# Altium schematic sheet SM3350_BOX.SchDoc
size A2; SheetNumber: 1; SheetTotal: 1
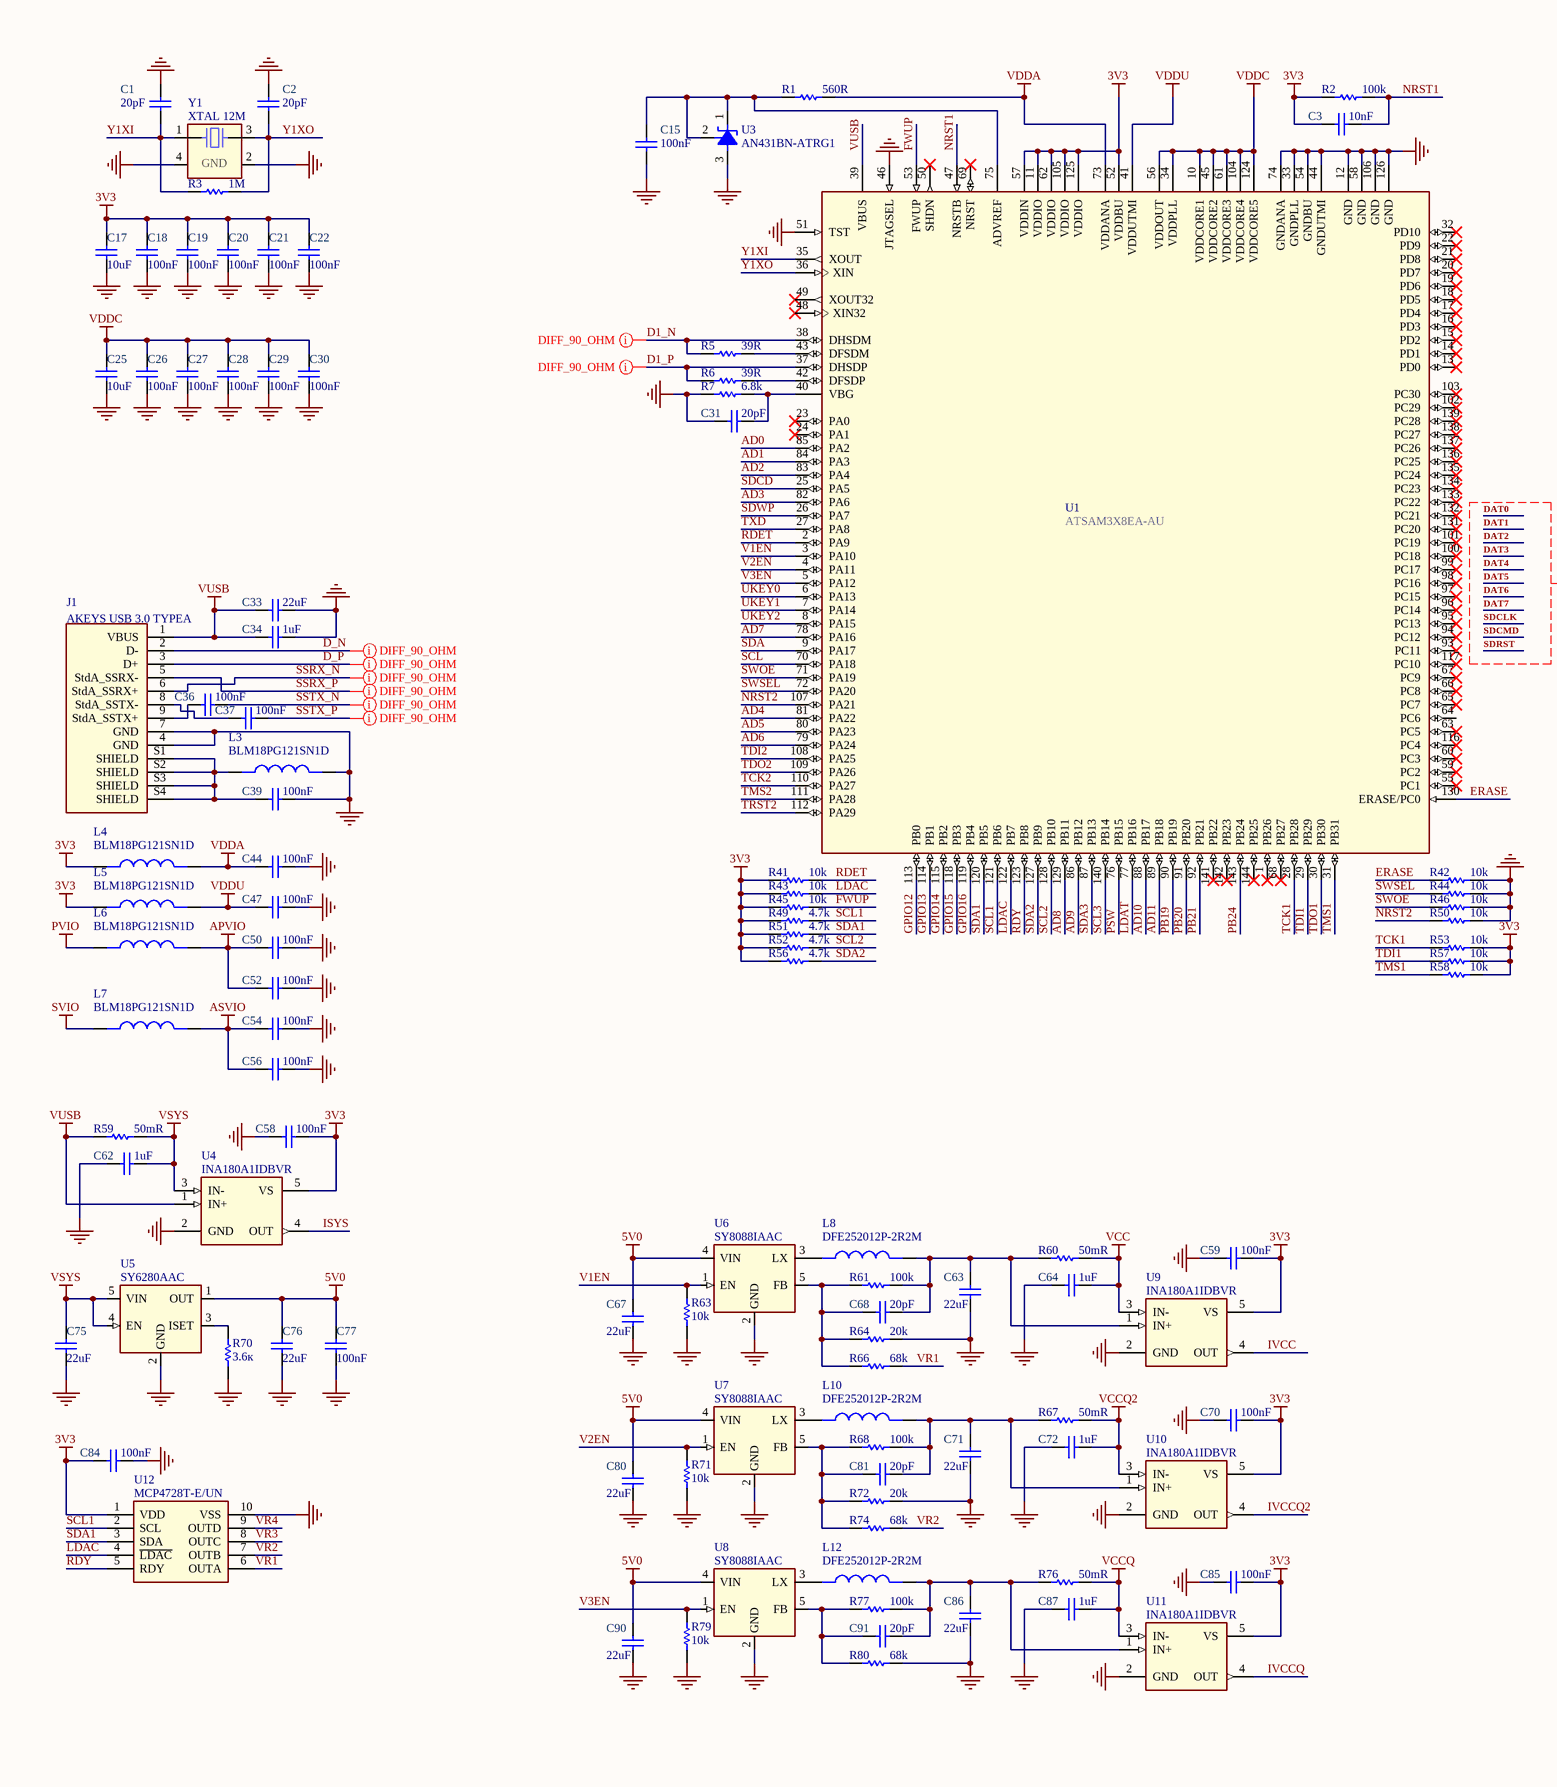
[diagram p0: SM3350_BOX.SchDoc, left]
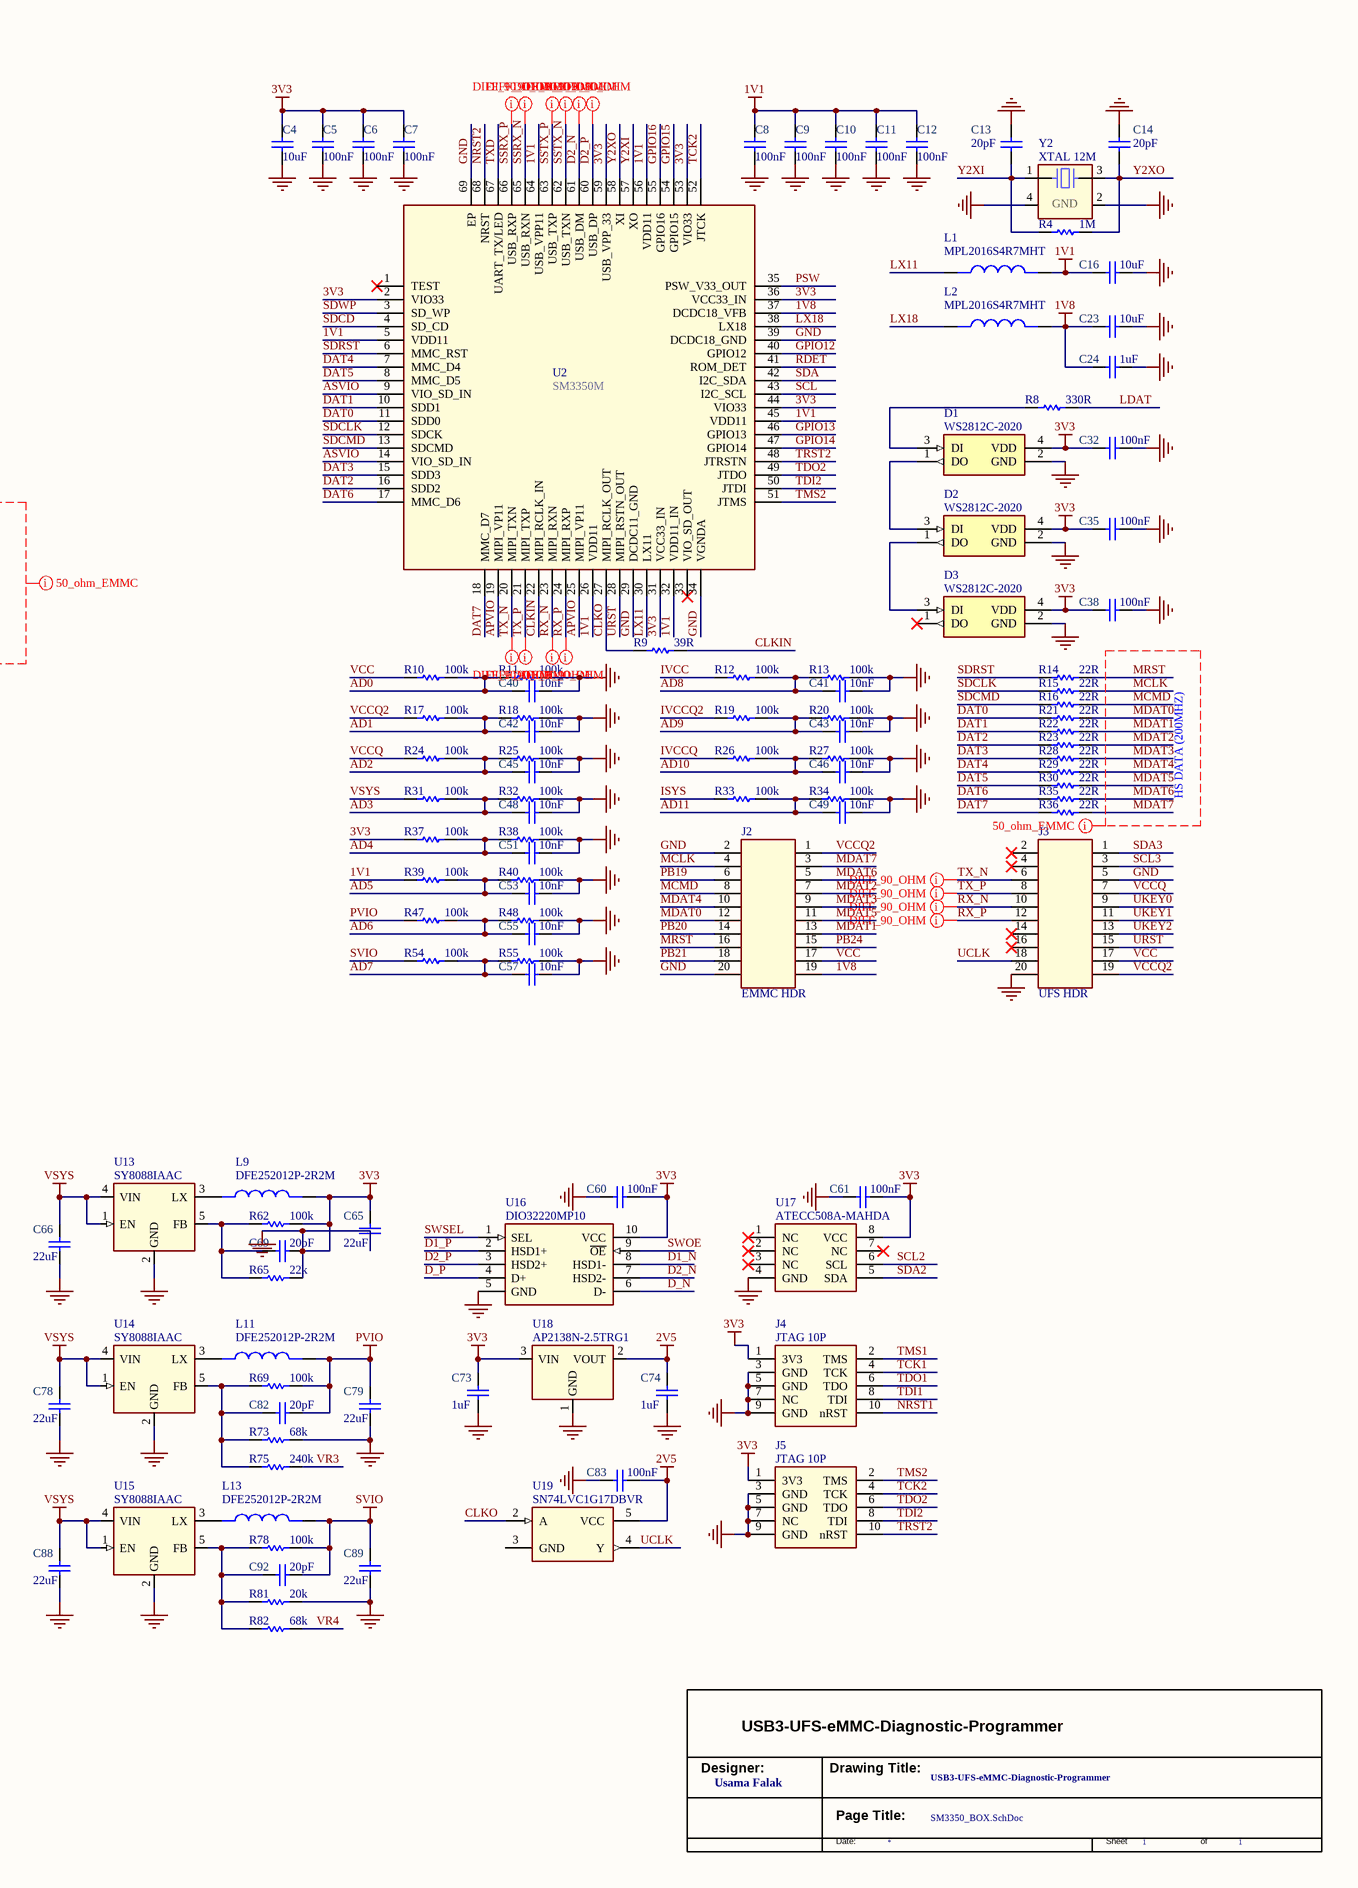
[diagram p1: SM3350_BOX.SchDoc, right]

## Parts
*  TitleBlock_MCPG  (value not drawn)  (graphical)
C1  value 20pF  [CAP_0402]  (hidden comment: CAP0402)
C2  value 20pF  [CAP_0402]  (hidden comment: CAP0402)
C3  value 10nF  [CAP_0402]  (hidden comment: CAP0402)
C4  value 10uF  [CAP_0805]  (hidden comment: CAP0805)
C5  value 100nF  [CAP_0402]  (hidden comment: CAP0402)
C6  value 100nF  [CAP_0402]  (hidden comment: CAP0402)
C7  value 100nF  [CAP_0402]  (hidden comment: CAP0402)
C8  value 100nF  [CAP_0402]  (hidden comment: CAP0402)
C9  value 100nF  [CAP_0402]  (hidden comment: CAP0402)
C10  value 100nF  [CAP_0402]  (hidden comment: CAP0402)
C11  value 100nF  [CAP_0402]  (hidden comment: CAP0402)
C12  value 100nF  [CAP_0402]  (hidden comment: CAP0402)
C13  value 20pF  [CAP_0402]  (hidden comment: CAP0402)
C14  value 20pF  [CAP_0402]  (hidden comment: CAP0402)
C15  value 100nF  [CAP_0402]  (hidden comment: CAP0402)
C16  value 10uF  [CAP_0805]  (hidden comment: CAP0805)
C17  value 10uF  [CAP_0805]  (hidden comment: CAP0805)
C18  value 100nF  [CAP_0402]  (hidden comment: CAP0402)
C19  value 100nF  [CAP_0402]  (hidden comment: CAP0402)
C20  value 100nF  [CAP_0402]  (hidden comment: CAP0402)
C21  value 100nF  [CAP_0402]  (hidden comment: CAP0402)
C22  value 100nF  [CAP_0402]  (hidden comment: CAP0402)
C23  value 10uF  [CAP_0805]  (hidden comment: CAP0805)
C24  value 1uF  [CAP_0402]  (hidden comment: CAP0402)
C25  value 10uF  [CAP_0805]  (hidden comment: CAP0805)
C26  value 100nF  [CAP_0402]  (hidden comment: CAP0402)
C27  value 100nF  [CAP_0402]  (hidden comment: CAP0402)
C28  value 100nF  [CAP_0402]  (hidden comment: CAP0402)
C29  value 100nF  [CAP_0402]  (hidden comment: CAP0402)
C30  value 100nF  [CAP_0402]  (hidden comment: CAP0402)
C31  value 20pF  [CAP_0402]  (hidden comment: CAP0402)
C32  value 100nF  [CAP_0402]  (hidden comment: CAP0402)
C33  value 22uF  [CAP_0805]  (hidden comment: CAP0805)
C34  value 1uF  [CAP_0402]  (hidden comment: CAP0402)
C35  value 100nF  [CAP_0402]  (hidden comment: CAP0402)
C36  value 100nF  [CAP_0402]  (hidden comment: CAP0402)
C37  value 100nF  [CAP_0402]  (hidden comment: CAP0402)
C38  value 100nF  [CAP_0402]  (hidden comment: CAP0402)
C39  value 100nF  [CAP_0402]  (hidden comment: CAP0402)
C40  value 10nF  [CAP_0402]  (hidden comment: CAP0402)
C41  value 10nF  [CAP_0402]  (hidden comment: CAP0402)
C42  value 10nF  [CAP_0402]  (hidden comment: CAP0402)
C43  value 10nF  [CAP_0402]  (hidden comment: CAP0402)
C44  value 100nF  [CAP_0402]  (hidden comment: CAP0402)
C45  value 10nF  [CAP_0402]  (hidden comment: CAP0402)
C46  value 10nF  [CAP_0402]  (hidden comment: CAP0402)
C47  value 100nF  [CAP_0402]  (hidden comment: CAP0402)
C48  value 10nF  [CAP_0402]  (hidden comment: CAP0402)
C49  value 10nF  [CAP_0402]  (hidden comment: CAP0402)
C50  value 100nF  [CAP_0402]  (hidden comment: CAP0402)
C51  value 10nF  [CAP_0402]  (hidden comment: CAP0402)
C52  value 100nF  [CAP_0402]  (hidden comment: CAP0402)
C53  value 10nF  [CAP_0402]  (hidden comment: CAP0402)
C54  value 100nF  [CAP_0402]  (hidden comment: CAP0402)
C55  value 10nF  [CAP_0402]  (hidden comment: CAP0402)
C56  value 100nF  [CAP_0402]  (hidden comment: CAP0402)
C57  value 10nF  [CAP_0402]  (hidden comment: CAP0402)
C58  value 100nF  [CAP_0402]  (hidden comment: CAP0402)
C59  value 100nF  [CAP_0402]  (hidden comment: CAP0402)
C60  value 100nF  [CAP_0402]  (hidden comment: CAP0402)
C61  value 100nF  [CAP_0402]  (hidden comment: CAP0402)
C62  value 1uF  [CAP_0402]  (hidden comment: CAP0402)
C63  value 22uF  [CAP_0805]  (hidden comment: CAP0805)
C64  value 1uF  [CAP_0402]  (hidden comment: CAP0402)
C65  value 22uF  [CAP_0805]  (hidden comment: CAP0805)
C66  value 22uF  [CAP_0805]  (hidden comment: CAP0805)
C67  value 22uF  [CAP_0805]  (hidden comment: CAP0805)
C68  value 20pF  [CAP_0402]  (hidden comment: CAP0402)
C69  value 20pF  [CAP_0402]  (hidden comment: CAP0402)
C70  value 100nF  [CAP_0402]  (hidden comment: CAP0402)
C71  value 22uF  [CAP_0805]  (hidden comment: CAP0805)
C72  value 1uF  [CAP_0402]  (hidden comment: CAP0402)
C73  value 1uF  [CAP_0402]  (hidden comment: CAP0402)
C74  value 1uF  [CAP_0402]  (hidden comment: CAP0402)
C75  value 22uF  [CAP_0805]  (hidden comment: CAP0805)
C76  value 22uF  [CAP_0805]  (hidden comment: CAP0805)
C77  value 100nF  [CAP_0402]  (hidden comment: CAP0402)
C78  value 22uF  [CAP_0805]  (hidden comment: CAP0805)
C79  value 22uF  [CAP_0805]  (hidden comment: CAP0805)
C80  value 22uF  [CAP_0805]  (hidden comment: CAP0805)
C81  value 20pF  [CAP_0402]  (hidden comment: CAP0402)
C82  value 20pF  [CAP_0402]  (hidden comment: CAP0402)
C83  value 100nF  [CAP_0402]  (hidden comment: CAP0402)
C84  value 100nF  [CAP_0402]  (hidden comment: CAP0402)
C85  value 100nF  [CAP_0402]  (hidden comment: CAP0402)
C86  value 22uF  [CAP_0805]  (hidden comment: CAP0805)
C87  value 1uF  [CAP_0402]  (hidden comment: CAP0402)
C88  value 22uF  [CAP_0805]  (hidden comment: CAP0805)
C89  value 22uF  [CAP_0805]  (hidden comment: CAP0805)
C90  value 22uF  [CAP_0805]  (hidden comment: CAP0805)
C91  value 20pF  [CAP_0402]  (hidden comment: CAP0402)
C92  value 20pF  [CAP_0402]  (hidden comment: CAP0402)
D1  WS2812C-2020  [LED_WS2812C-2020]
D2  WS2812C-2020  [LED_WS2812C-2020]
D3  WS2812C-2020  [LED_WS2812C-2020]
J1  AKEYS USB 3.0 TYPEA  [AKEYS_USB3.0]
J2  EMMC HDR  [HDR20P]
J3  UFS HDR  [HDR20P]
J4  JTAG 10P  [HDR10P]
J5  JTAG 10P  [HDR10P]
L1  MPL2016S4R7MHT  [MPL2016S4R7MHT]
L2  MPL2016S4R7MHT  [MPL2016S4R7MHT]
L3  BLM18PG121SN1D  [FER 0603_1608]
L4  BLM18PG121SN1D  [FER 0603_1608]
L5  BLM18PG121SN1D  [FER 0603_1608]
L6  BLM18PG121SN1D  [FER 0603_1608]
L7  BLM18PG121SN1D  [FER 0603_1608]
L8  DFE252012P-2R2M  [DFE252012P-2R2M]
L9  DFE252012P-2R2M  [DFE252012P-2R2M]
L10  DFE252012P-2R2M  [DFE252012P-2R2M]
L11  DFE252012P-2R2M  [DFE252012P-2R2M]
L12  DFE252012P-2R2M  [DFE252012P-2R2M]
L13  DFE252012P-2R2M  [DFE252012P-2R2M]
R1  value 560R  [RES_0402]  (hidden comment: RES0402)
R2  value 100k  [RES_0402]  (hidden comment: RES0402)
R3  value 1M  [RES_0402]  (hidden comment: RES0402)
R4  value 1M  [RES_0402]  (hidden comment: RES0402)
R5  value 39R  [RES_0402]  (hidden comment: RES0402)
R6  value 39R  [RES_0402]  (hidden comment: RES0402)
R7  value 6.8k  [RES_0402]  (hidden comment: RES0402)
R8  value 330R  [RES_0402]  (hidden comment: RES0402)
R9  value 39R  [RES_0402]  (hidden comment: RES0402)
R10  value 100k  [RES_0402]  (hidden comment: RES0402)
R11  value 100k  [RES_0402]  (hidden comment: RES0402)
R12  value 100k  [RES_0402]  (hidden comment: RES0402)
R13  value 100k  [RES_0402]  (hidden comment: RES0402)
R14  value 22R  [RES_0402]  (hidden comment: RES0402)
R15  value 22R  [RES_0402]  (hidden comment: RES0402)
R16  value 22R  [RES_0402]  (hidden comment: RES0402)
R17  value 100k  [RES_0402]  (hidden comment: RES0402)
R18  value 100k  [RES_0402]  (hidden comment: RES0402)
R19  value 100k  [RES_0402]  (hidden comment: RES0402)
R20  value 100k  [RES_0402]  (hidden comment: RES0402)
R21  value 22R  [RES_0402]  (hidden comment: RES0402)
R22  value 22R  [RES_0402]  (hidden comment: RES0402)
R23  value 22R  [RES_0402]  (hidden comment: RES0402)
R24  value 100k  [RES_0402]  (hidden comment: RES0402)
R25  value 100k  [RES_0402]  (hidden comment: RES0402)
R26  value 100k  [RES_0402]  (hidden comment: RES0402)
R27  value 100k  [RES_0402]  (hidden comment: RES0402)
R28  value 22R  [RES_0402]  (hidden comment: RES0402)
R29  value 22R  [RES_0402]  (hidden comment: RES0402)
R30  value 22R  [RES_0402]  (hidden comment: RES0402)
R31  value 100k  [RES_0402]  (hidden comment: RES0402)
R32  value 100k  [RES_0402]  (hidden comment: RES0402)
R33  value 100k  [RES_0402]  (hidden comment: RES0402)
R34  value 100k  [RES_0402]  (hidden comment: RES0402)
R35  value 22R  [RES_0402]  (hidden comment: RES0402)
R36  value 22R  [RES_0402]  (hidden comment: RES0402)
R37  value 100k  [RES_0402]  (hidden comment: RES0402)
R38  value 100k  [RES_0402]  (hidden comment: RES0402)
R39  value 100k  [RES_0402]  (hidden comment: RES0402)
R40  value 100k  [RES_0402]  (hidden comment: RES0402)
R41  value 10k  [RES_0402]  (hidden comment: RES0402)
R42  value 10k  [RES_0402]  (hidden comment: RES0402)
R43  value 10k  [RES_0402]  (hidden comment: RES0402)
R44  value 10k  [RES_0402]  (hidden comment: RES0402)
R45  value 10k  [RES_0402]  (hidden comment: RES0402)
R46  value 10k  [RES_0402]  (hidden comment: RES0402)
R47  value 100k  [RES_0402]  (hidden comment: RES0402)
R48  value 100k  [RES_0402]  (hidden comment: RES0402)
R49  value 4.7k  [RES_0402]  (hidden comment: RES0402)
R50  value 10k  [RES_0402]  (hidden comment: RES0402)
R51  value 4.7k  [RES_0402]  (hidden comment: RES0402)
R52  value 4.7k  [RES_0402]  (hidden comment: RES0402)
R53  value 10k  [RES_0402]  (hidden comment: RES0402)
R54  value 100k  [RES_0402]  (hidden comment: RES0402)
R55  value 100k  [RES_0402]  (hidden comment: RES0402)
R56  value 4.7k  [RES_0402]  (hidden comment: RES0402)
R57  value 10k  [RES_0402]  (hidden comment: RES0402)
R58  value 10k  [RES_0402]  (hidden comment: RES0402)
R59  value 50mR  [RES 1206]  (hidden comment: RES1206)
R60  value 50mR  [RES 1206]  (hidden comment: RES1206)
R61  value 100k  [RES_0402]  (hidden comment: RES0402)
R62  value 100k  [RES_0402]  (hidden comment: RES0402)
R63  value 10k  [RES_0402]  (hidden comment: RES0402)
R64  value 20k  [RES_0402]  (hidden comment: RES0402)
R65  value 22k  [RES_0402]  (hidden comment: RES0402)
R66  value 68k  [RES_0402]  (hidden comment: RES0402)
R67  value 50mR  [RES 1206]  (hidden comment: RES1206)
R68  value 100k  [RES_0402]  (hidden comment: RES0402)
R69  value 100k  [RES_0402]  (hidden comment: RES0402)
R70  value 3.6к  [RES_0402]  (hidden comment: RES0402)
R71  value 10k  [RES_0402]  (hidden comment: RES0402)
R72  value 20k  [RES_0402]  (hidden comment: RES0402)
R73  value 68k  [RES_0402]  (hidden comment: RES0402)
R74  value 68k  [RES_0402]  (hidden comment: RES0402)
R75  value 240k  [RES_0402]  (hidden comment: RES0402)
R76  value 50mR  [RES 1206]  (hidden comment: RES1206)
R77  value 100k  [RES_0402]  (hidden comment: RES0402)
R78  value 100k  [RES_0402]  (hidden comment: RES0402)
R79  value 10k  [RES_0402]  (hidden comment: RES0402)
R80  value 68k  [RES_0402]  (hidden comment: RES0402)
R81  value 20k  [RES_0402]  (hidden comment: RES0402)
R82  value 68k  [RES_0402]  (hidden comment: RES0402)
U1  ATSAM3X8EA-AU  [TQFP-144]
U2  SM3350M  [QFN-68]
U3  AN431BN-ATRG1  [SOT-23-3]
U4  INA180A1IDBVR  [SOT-23-5]
U5  SY6280AAC  [SOT-23-5]
U6  SY8088IAAC  [SOT-23-5]
U7  SY8088IAAC  [SOT-23-5]
U8  SY8088IAAC  [SOT-23-5]
U9  INA180A1IDBVR  [SOT-23-5]
U10  INA180A1IDBVR  [SOT-23-5]
U11  INA180A1IDBVR  [SOT-23-5]
U12  MCP4728T-E/UN  [MSOP-10]
U13  SY8088IAAC  [SOT-23-5]
U14  SY8088IAAC  [SOT-23-5]
U15  SY8088IAAC  [SOT-23-5]
U16  DIO32220MP10  [MSOP-10]
U17  value ATECC508A-MAHDA  [ATECC508A]  (hidden comment: CRYPTO CHIP)
U18  AP2138N-2.5TRG1  [SOT-23-3]
U19  SN74LVC1G17DBVR  [SOT-23-5]
Y1  XTAL 12M  [X322512MSB4SI]
Y2  XTAL 12M  [X322512MSB4SI]

## Nets
1V1: C8.2 C9.2 C10.2 C11.2 C12.2 C16.2 L1.2 R39.2 U2.5(VDD11) U2.26(VDD11) U2.32(VDD11_IN) U2.45(VDD11) U2.56(VDD11) U2.64(USB_VPP11)
1V8: C23.2 C24.1 J2.19 L2.2 U2.37(DCDC18_VFB)
2V5: C74.2 C83.2 U18.2(VOUT) U19.5(VCC)
3V3: C1.1 C2.1 C3.1 C4.1 C4.2 C5.1 C5.2 C6.1 C6.2 C7.1 C7.2 C8.1 C9.1 C10.1 C11.1 C12.1 C13.1 C14.1 C15.2 C16.1 C17.1 C17.2 C18.1 C18.2 C19.1 C19.2 C20.1 C20.2 C21.1 C21.2 C22.1 C22.2 C23.1 C24.2 C25.1 C26.1 C27.1 C28.1 C29.1 C30.1 C31.1 C32.1 C32.2 C33.1 C34.2 C35.1 C35.2 C38.1 C38.2 C39.2 C40.2 C41.2 C42.2 C43.2 C44.2 C45.2 C46.2 C47.2 C48.2 C49.2 C50.2 C51.2 C52.2 C53.2 C54.2 C55.2 C56.2 C57.2 C58.1 C58.2 C59.1 C59.2 C60.1 C60.2 C61.1 C61.2 C62.1 C63.1 C64.1 C65.1 C65.2 C66.1 C67.1 C69.2 C70.1 C70.2 C71.1 C72.1 C73.1 C73.2 C74.1 C75.1 C76.1 C77.1 C78.1 C79.1 C80.1 C83.1 C84.1 C84.2 C85.1 C85.2 C86.1 C87.1 C88.1 C89.1 C90.1 D1.2(GND) D1.4(VDD) D2.2(GND) D2.4(VDD) D3.2(GND) D3.4(VDD) J1.4(GND) J1.7(GND) J2.2 J2.20 J3.5 J3.20 J4.1(3V3) J4.3(GND) J4.5(GND) J4.7(NC) J4.9(GND) J5.1(3V3) J5.3(GND) J5.5(GND) J5.7(NC) J5.9(GND) L3.2 L4.1 L5.1 L9.2 R2.2 R7.1 R11.1 R13.1 R18.1 R20.1 R25.1 R27.1 R32.1 R34.1 R37.2 R38.1 R40.1 R41.2 R42.1 R43.2 R44.1 R45.2 R46.1 R48.1 R49.2 R50.1 R51.2 R52.2 R53.1 R55.1 R56.2 R57.1 R58.1 R62.2 R63.1 R64.2 R65.2 R70.1 R71.1 R72.2 R73.2 R79.1 R80.2 R81.2 U1.11(VDDIO) U1.12(GND) U1.33(GNDPLL) U1.44(GNDUTMI) U1.46(JTAGSEL) U1.51(TST) U1.52(VDDBU) U1.54(GNDBU) U1.57(VDDIN) U1.58(GND) U1.62(VDDIO) U1.74(GNDANA) U1.105(VDDIO) U1.106(GND) U1.125(VDDIO) U1.126(GND) U2.2(VIO33) U2.29(DCDC11_GND) U2.31(VCC33_IN) U2.34(VGNDA) U2.36(VCC33_IN) U2.39(DCDC18_GND) U2.44(VIO33) U2.53(VIO33) U2.59(USB_VPP_33) U2.69(EP) U3.3(ANODE) U4.2(GND) U4.5(VS) U5.2(GND) U6.2(GND) U7.2(GND) U8.2(GND) U9.2(GND) U9.5(VS) U10.2(GND) U10.5(VS) U11.2(GND) U11.5(VS) U12.1(VDD) U12.10(VSS) U13.2(GND) U14.2(GND) U15.2(GND) U16.5(GND) U16.10(VCC) U17.4(GND) U17.8(VCC) U18.1(GND) U18.3(VIN) Y1.2(GND) Y1.4(GND) Y2.2(GND) Y2.4(GND)  [also labelled GND]
5V0: C67.2 C76.2 C77.2 C80.2 C90.2 U5.1(OUT) U6.4(VIN) U7.4(VIN) U8.4(VIN)
APVIO: C50.1 C52.1 L6.2 U2.19(MIPI_VP11) U2.25(MIPI_VP11)
ASVIO: C54.1 C56.1 L7.2 U2.9(VIO_SD_IN) U2.14(VIO_SD_IN)
PVIO: C79.2 C82.2 L6.1 L11.2 R47.2 R69.2
SVIO: C89.2 C92.2 L7.1 L13.2 R54.2 R78.2
VCC: C64.2 J2.17 J3.17 R10.2 R60.2 U9.3(IN-)
VCCQ: C87.2 J3.7 R24.2 R76.2 U11.3(IN-)
VCCQ2: C72.2 J2.1 J3.19 R17.2 R67.2 U10.3(IN-)
VDDA: C44.1 L4.2 R1.2 U1.73(VDDANA)
VDDC: C25.2 C26.2 C27.2 C28.2 C29.2 C30.2 U1.10(VDDCORE1) U1.34(VDDPLL) U1.45(VDDCORE2) U1.56(VDDOUT) U1.61(VDDCORE3) U1.104(VDDCORE4) U1.124(VDDCORE5)
VDDU: C47.1 L5.2 U1.41(VDDUTMI)
VSYS: C62.2 C66.2 C75.2 C78.2 C88.2 R31.2 R59.2 U4.3(IN-) U5.4(EN) U5.5(VIN) U13.1(EN) U13.4(VIN) U14.1(EN) U14.4(VIN) U15.1(EN) U15.4(VIN)
VUSB: C33.2 C34.1 J1.1(VBUS) R59.1 U1.39(VBUS) U4.1(IN+)
AD0: C40.1 R10.1 R11.2 U1.85(PA2)
AD1: C42.1 R17.1 R18.2 U1.84(PA3)
AD2: C45.1 R24.1 R25.2 U1.83(PA4)
AD3: C48.1 R31.1 R32.2 U1.82(PA6)
AD4: C51.1 R37.1 R38.2 U1.81(PA22)
AD5: C53.1 R39.1 R40.2 U1.80(PA23)
AD6: C55.1 R47.1 R48.2 U1.79(PA24)
AD7: C57.1 R54.1 R55.2 U1.78(PA16)
AD8: C41.1 R12.1 R13.2 U1.129(PB11)
AD9: C43.1 R19.1 R20.2 U1.86(PB12)
AD10: C46.1 R26.1 R27.2 U1.88(PB17)
AD11: C49.1 R33.1 R34.2 U1.89(PB18)
CLKIN: R9.1 U2.22(MIPI_RCLK_IN)
CLKO: R9.2 U2.27(MIPI_RCLK_OUT) U19.2(A)
D1_N: R5.1 U1.38(DHSDM) U16.8(HSD1-)
D1_P: R6.1 U1.37(DHSDP) U16.2(HSD1+)
D2_N: U2.61(USB_DM) U16.7(HSD2-)
D2_P: U2.60(USB_DP) U16.3(HSD2+)
D_N: J1.2(D-) U16.6(D-)
D_P: J1.3(D+) U16.4(D+)
DAT0: R21.2 U2.11(SDD0)
DAT1: R22.2 U2.10(SDD1)
DAT2: R23.2 U2.16(SDD2)
DAT3: R28.2 U2.15(SDD3)
DAT4: R29.2 U2.7(MMC_D4)
DAT5: R30.2 U2.8(MMC_D5)
DAT6: R35.2 U2.17(MMC_D6)
DAT7: R36.2 U2.18(MMC_D7)
ERASE: R42.2 U1.130(ERASE/PC0)
FWUP: R45.1 U1.53(FWUP)
GPIO12: U1.113(PB0) U2.40(GPIO12)
GPIO13: U1.114(PB1) U2.46(GPIO13)
GPIO14: U1.115(PB2) U2.47(GPIO14)
GPIO15: U1.118(PB3) U2.54(GPIO15)
GPIO16: U1.119(PB4) U2.55(GPIO16)
ISYS: R33.2 U4.4(OUT)
IVCC: R12.2 U9.4(OUT)
IVCCQ: R26.2 U11.4(OUT)
IVCCQ2: R19.2 U10.4(OUT)
LDAC: R43.1 U1.122(PB7) U12.4(~{LDAC})
LDAT: R8.1 U1.77(PB16)
LX11: L1.1 U2.30(LX11)
LX18: L2.1 U2.38(LX18)
MCLK: J2.4 R15.1
MCMD: J2.8 R16.1
MDAT0: J2.12 R21.1
MDAT1: J2.13 R22.1
MDAT2: J2.7 R23.1
MDAT3: J2.9 R28.1
MDAT4: J2.10 R29.1
MDAT5: J2.11 R30.1
MDAT6: J2.5 R35.1
MDAT7: J2.3 R36.1
MRST: J2.16 R14.1
NRST1: C3.2 J4.10(nRST) R2.1 U1.47(NRSTB)
NRST2: R50.2 U1.107(PA21) U2.68(NRST)
PB19: J2.6 U1.90(PB19)
PB20: J2.14 U1.91(PB20)
PB21: J2.18 U1.92(PB21)
PB24: J2.15 U1.143(PB24)
PSW: U1.76(PB15) U2.35(PSW_V33_OUT)
RDET: R41.1 U1.2(PA9) U2.41(ROM_DET)
RDY: U1.123(PB8) U12.5(RDY)
RX_N: J3.10 U2.23(MIPI_RXN)
RX_P: J3.12 U2.24(MIPI_RXP)
SCL: U1.70(PA18) U2.43(I2C_SCL)
SCL1: R49.1 U1.121(PB6) U12.2(SCL)
SCL2: R52.1 U1.128(PB10) U17.6(SCL)
SCL3: J3.3 U1.140(PB14)
SDA: U1.9(PA17) U2.42(I2C_SDA)
SDA1: R51.1 U1.120(PB5) U12.3(SDA)
SDA2: R56.1 U1.127(PB9) U17.5(SDA)
SDA3: J3.1 U1.87(PB13)
SDCD: U1.25(PA5) U2.4(SD_CD)
SDCLK: R15.2 U2.12(SDCK)
SDCMD: R16.2 U2.13(SDCMD)
SDRST: R14.2 U2.6(MMC_RST)
SDWP: U1.26(PA7) U2.3(SD_WP)
SSRX_N: J1.6(StdA_SSRX+) U2.65(USB_RXN)
SSRX_P: J1.5(StdA_SSRX-) U2.66(USB_RXP)
SSTX_N: C36.2 U2.62(USB_TXN)
SSTX_P: C37.2 U2.63(USB_TXP)
SWOE: R46.2 U1.71(PA19) U16.9(~{OE})
SWSEL: R44.2 U1.72(PA20) U16.1(SEL)
TCK1: J4.4(TCK) R53.2 U1.28(PB28)
TCK2: J5.4(TCK) U1.110(PA27) U2.52(JTCK)
TDI1: J4.8(TDI) R57.2 U1.29(PB29)
TDI2: J5.8(TDI) U1.108(PA25) U2.50(JTDI)
TDO1: J4.6(TDO) U1.30(PB30)
TDO2: J5.6(TDO) U1.109(PA26) U2.49(JTDO)
TMS1: J4.2(TMS) R58.2 U1.31(PB31)
TMS2: J5.2(TMS) U1.111(PA28) U2.51(JTMS)
TRST2: J5.10(nRST) U1.112(PA29) U2.48(JTRSTN)
TX_N: J3.6 U2.20(MIPI_TXN)
TX_P: J3.8 U2.21(MIPI_TXP)
TXD: U1.27(PA8) U2.67(UART_TX/LED)
UCLK: J3.18 U19.4(Y)
UKEY0: J3.9 U1.6(PA13)
UKEY1: J3.11 U1.7(PA14)
UKEY2: J3.13 U1.8(PA15)
URST: J3.15 U2.28(MIPI_RSTN_OUT)
V1EN: R63.2 U1.3(PA10) U6.1(EN)
V2EN: R71.2 U1.4(PA11) U7.1(EN)
V3EN: R79.2 U1.5(PA12) U8.1(EN)
VR1: R66.2 U12.6(OUTA)
VR2: R74.2 U12.7(OUTB)
VR3: R75.2 U12.8(OUTC)
VR4: R82.2 U12.9(OUTD)
Y1XI: C1.2 R3.1 U1.35(XOUT) Y1.1
Y1XO: C2.2 R3.2 U1.36(XIN) Y1.3
Y2XI: C13.2 R4.1 U2.57(XO) Y2.1
Y2XO: C14.2 R4.2 U2.58(XI) Y2.3
NetC15_1: C15.1 R1.1 U1.75(ADVREF) U3.1(CATHODE) U3.2(REF)
NetC31_2: C31.2 R7.2 U1.40(VBG)
NetC36_1: C36.1 J1.9(StdA_SSTX+)
NetC37_1: C37.1 J1.8(StdA_SSTX-)
NetC39_1: C39.1 J1.S1(SHIELD) J1.S2(SHIELD) J1.S3(SHIELD) J1.S4(SHIELD) L3.1
NetC63_2: C63.2 C68.2 L8.2 R60.1 R61.2 U9.1(IN+)
NetC68_1: C68.1 R61.1 R64.1 R66.1 U6.5(FB)
NetC69_1: C69.1 R62.1 R65.1 U13.5(FB)
NetC71_2: C71.2 C81.2 L10.2 R67.1 R68.2 U10.1(IN+)
NetC81_1: C81.1 R68.1 R72.1 R74.1 U7.5(FB)
NetC82_1: C82.1 R69.1 R73.1 R75.1 U14.5(FB)
NetC86_2: C86.2 C91.2 L12.2 R76.1 R77.2 U11.1(IN+)
NetC91_1: C91.1 R77.1 R80.1 U8.5(FB)
NetC92_1: C92.1 R78.1 R81.1 R82.1 U15.5(FB)
NetD1_1: D1.1(DO) D2.3(DI)
NetD1_3: D1.3(DI) R8.2
NetD2_1: D2.1(DO) D3.3(DI)
NetL8_1: L8.1 U6.3(LX)
NetL9_1: L9.1 U13.3(LX)
NetL10_1: L10.1 U7.3(LX)
NetL11_1: L11.1 U14.3(LX)
NetL12_1: L12.1 U8.3(LX)
NetL13_1: L13.1 U15.3(LX)
NetR5_2: R5.2 U1.43(DFSDM)
NetR6_2: R6.2 U1.42(DFSDP)
NetR70_2: R70.2 U5.3(ISET)

Not connected (* = marked no-connect by the designer): D3 1(DO)*; J3 2* 4* 14* 16*; U1 1(PB26)* 13(PD0)* 14(PD1)* 15(PD2)* 16(PD3)* 17(PD4)* 18(PD5)* 19(PD6)* 20(PD7)* 21(PD8)* 22(PD9)* 23(PA0)* 24(PA1)* 32(PD10)* 48(XIN32)* 49(XOUT32)* 50(SHDN)* 55(PC1)* 59(PC2)* 60(PC3)* 63(PC5)* 64(PC6) 65(PC7)* 66(PC8)* 67(PC9)* 68(PB27)* 69(NRST)* 93(PC11)* 94(PC12)* 95(PC13)* 96(PC14)* 97(PC15)* 98(PC16)* 99(PC17)* 100(PC18)* 101(PC19)* 102(PC29)* 103(PC30)* 116(PC4)* 117(PC10)* 131(PC20)* 132(PC21)* 133(PC22)* 134(PC23)* 135(PC24)* 136(PC25)* 137(PC26)* 138(PC27)* 139(PC28)* 141(PB22)* 142(PB23)* 144(PB25)*; U2 1(TEST)* 33(VIO_SD_OUT)*; U17 1(NC)* 2(NC)* 3(NC)* 7(NC)*; U19 3(GND)

## Layout directives
differential pair; differential pair class 90_OHM: D1_N, D1_P, D2_N, D2_P, D_N, D_P, RX_N, RX_P, SSRX_N, SSRX_P, SSTX_N, SSTX_P, TX_N, TX_P
net class 50_OHM_EMMC: DAT0, DAT1, DAT2, DAT3, DAT4, DAT5, DAT6, DAT7, MCLK, MCMD, MDAT0, MDAT1, MDAT2, MDAT3, MDAT4, MDAT5, MDAT6, MDAT7, MRST, SDCLK, SDCMD, SDRST

## Notes on the sheet
- HS DATA (200MHZ)
- (in symbol TitleBlock_MCPG) USB3-UFS-eMMC-Diagnostic-Programmer; Designer:; Drawing Title:; Usama Falak; Page Title:; Date:; Sheet; of

## Library data of the parts
C1-C3 C5-C15 C18-C22 C24 C26-C32 C34-C62 C64 C68-C70 C72-C74 C77 C81-C85 C87 C91 C92 = CAP0402: CAP 0402; PartNumber: CL05A105KP5NNNC; Package: 0402; JLC PCB Part Number: C14445; Digikey Part Number: CL05A105KO5NNNC
C4 C16 C17 C23 C25 C33 C63 C65-C67 C71 C75 C76 C78-C80 C86 C88-C90 = CAP0805: CAP 0805; PartNumber: CL05A105KP5NNNC; Package: 0402; JLC PCB Part Number: C14445; Digikey Part Number: CL05A105KO5NNNC
D1-D3 = WS2812C-2020: Intelligent control LED integrated light source; MF: Worldsemi; SnapEDA_Link: https://www.snapeda.com/parts/WS2812C-2020/Worldsemi/view-part/?ref=snap; Package: Package; Value: WS2812C-2020; MP: WS2812C-2020; Check_prices: https://www.snapeda.com/parts/WS2812C-2020/Worldsemi/view-part/?ref=eda
J1 = USB3.0: USB 3.0 TYPE A AKEYS; Value: USB3.0 TYPE-A
J2 J3 = HDR20P: Value: A2541WR-2x10P
J4 J5 = JTAG: JTAG 10P 1.27mm; Value: JTAG
L1 L2 = MPL2016S4R7MHT: POWER INDUCTOR; Package: 2012 Bourns; Value: MPL2016S4R7MHT
L3-L7 = BLM18PG121SN1D: FERRITE BEAD; Package: 2012 Bourns; Value: BLM18PG121SN1D
L8-L13 = DFE252012P-2R2M: POWER INDUCTOR; Package: 2012 Bourns; Value: DFE252012P-2R2M
R1-R58 R61-R66 R68-R75 R77-R82 = RES0402: RES 0402; Package: 0402; Digikey Part Number: ERJ-2RKF1243X; Supplier: DIGIKEY
R59 R60 R67 R76 = RES1206: RES 1206; Package: 0402; Digikey Part Number: ERJ-2RKF1243X; Supplier: DIGIKEY
U1 = ATSAM3X8EA-AU: MCU 32BIT 512KB; Value: ATSAM3X8EA-AU
U2 = SM3350M: UFS TO USB BRIDGE; Package: QFN 68; Value: SM3350M
U3 = AN431BN-ATRG1: ADJ SHUNT REG; Value: AN431BN-ATRG1
U4 U9-U11 = INA180A1IDBVR: CURRENT SENSE 20V/V; MF: Texas Instruments; MP: INA180B1IDBVT; SnapEDA_Link: https://www.snapeda.com/parts/INA180B1IDBVT/Texas+Instruments/view-part/?ref=snap; Package: SOT-23-5 Texas Instruments; Value: INA180A1IDBVR; Check_prices: https://www.snapeda.com/parts/INA180B1IDBVT/Texas+Instruments/view-part/?ref=eda
U5 = SY6280AAC: POWER SWITCH; Value: SY6280AAC
U6-U8 U13-U15 = SY8088IAAC: DC TO DC STEP-DOWN; Value: SY8088IAAC
U12 = MCP4728T-E/UN: 12BIT DAC 4CH; Value: MCP4728T-E/UN
U16 = DIO32220MP10: USB2.0 SWITCH; Value: DIO32220MP10
U17 = ATECC508A-MAHDA
U18 = AP2138N-2.5TRG1: LDO 2.5V; Value: AP2138N-2.5TRG1
U19 = SN74LVC1G17DBVR: CLK BUFFER; MF: Texas Instruments; MP: SN74LVC1G17DCKRE4; SnapEDA_Link: https://www.snapeda.com/parts/SN74LVC1G17DCKRE4/Texas+Instruments/view-part/?ref=snap; Package: SC70-5 Texas Instruments; Value: SN74LVC1G17DBVR; Check_prices: https://www.snapeda.com/parts/SN74LVC1G17DCKRE4/Texas+Instruments/view-part/?ref=eda
Y1 Y2 = X322512MSB4SI: CRYSTAL 12MHZ; Value: X322512MSB4SI
* = TitleBlock_MCPG: Page Create Date: March  8, 1995